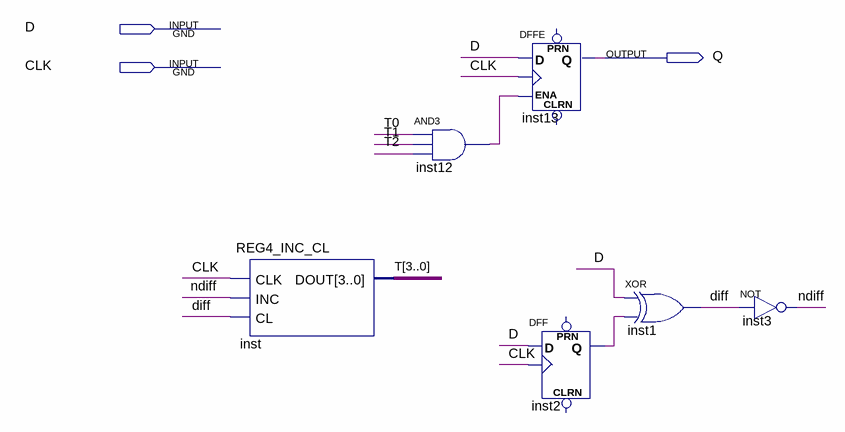
[diagram p0: schematic sheet]
// Quartus schematic kb_debouncer.bdf as structural Verilog: 6 symbols, 3 pins
module kb_debouncer (
  input  D,
  input  CLK,
  output Q
);

  wire diff, inst2_q, inst12_out, ndiff;
  wire [3:0] T;

  REG4_INC_CL inst (.CLK(CLK), .INC(ndiff), .CL(diff), .DOUT(T));
  and inst12 (inst12_out, T[0], T[1], T[2]);
  DFFE inst13 (.D(D), .CLK(CLK), .ENA(inst12_out), .Q(Q));  // open: PRN, CLRN
  DFF inst2 (.CLK(CLK), .D(D), .Q(inst2_q));  // open: CLRN, PRN
  xor inst1 (diff, D, inst2_q);
  not inst3 (ndiff, diff);
endmodule
